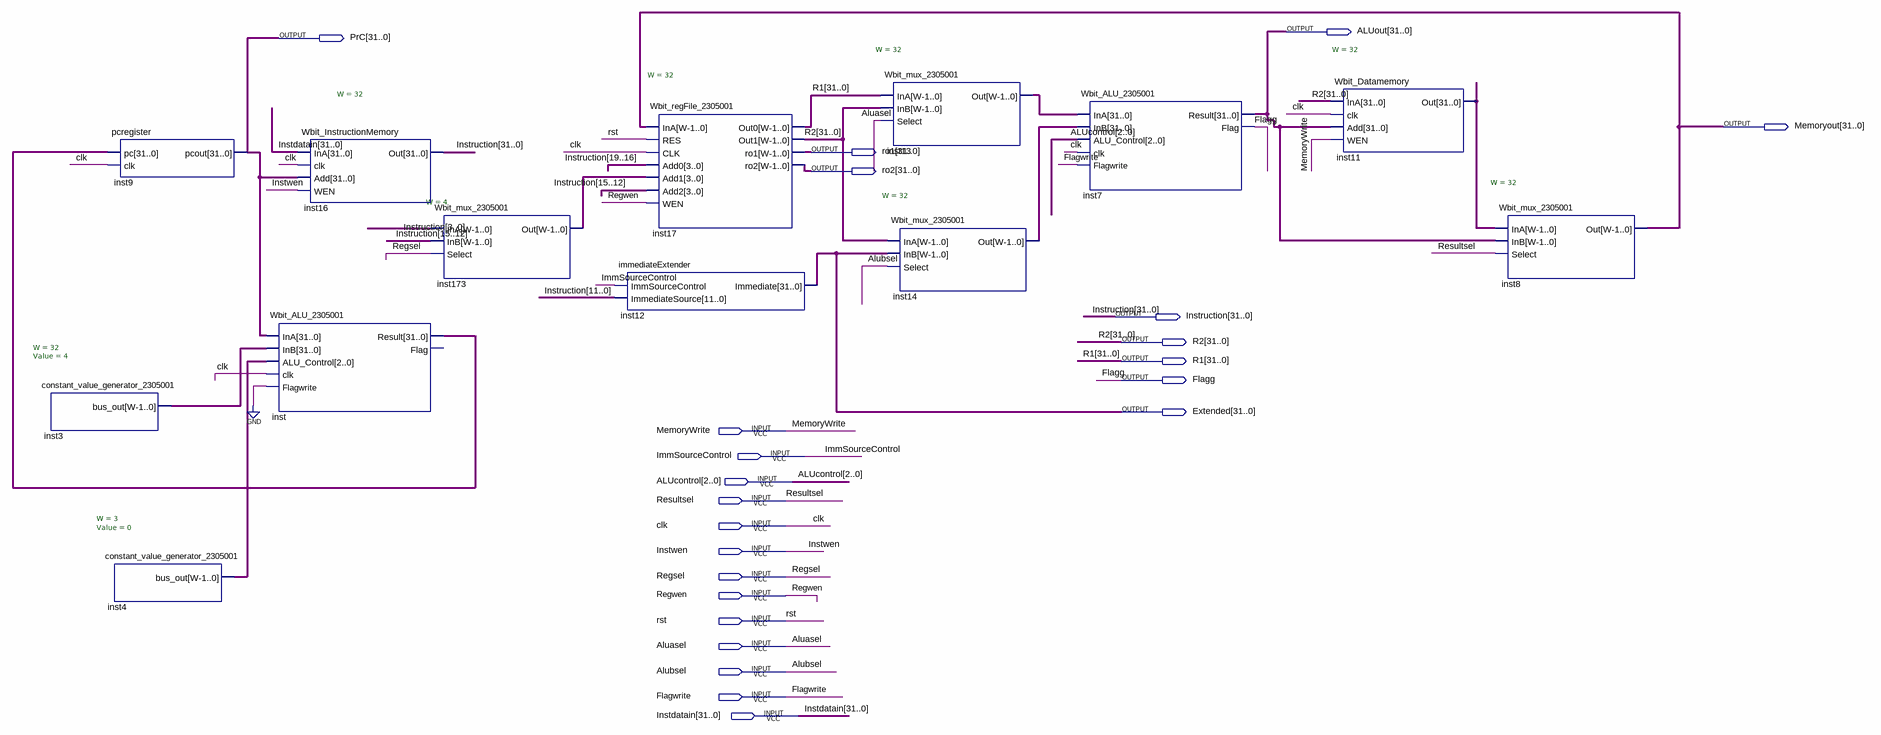
[diagram p0: schematic sheet]
// Quartus schematic Datapath.bdf as structural Verilog: 13 symbols, 23 pins
module Datapath (
  input  MemoryWrite,
  input  ImmSourceControl,
  input  [2:0] ALUcontrol,
  input  Resultsel,
  input  clk,
  input  Instwen,
  input  Regsel,
  input  Regwen,
  input  rst,
  input  Aluasel,
  input  Alubsel,
  input  Flagwrite,
  input  [31:0] Instdatain,
  output [31:0] ALUout,
  output [31:0] PrC,
  output [31:0] Memoryout,
  output [31:0] ro1,
  output [31:0] ro2,
  output [31:0] Instruction,
  output [31:0] R2,
  output [31:0] R1,
  output Flagg,
  output [31:0] Extended
);

  wire [2:0] inst4_bus_out;
  wire [3:0] inst173_out;
  wire [31:0] inst3_bus_out, inst11_out, inst13_out, inst14_out, inst_result;

  constant_value_generator_2305001 #(.W(32), .Value(4)) inst3 (.bus_out(inst3_bus_out));
  constant_value_generator_2305001 #(.W(3), .Value(0)) inst4 (.bus_out(inst4_bus_out));
  pcregister inst9 (.pc(inst_result), .clk(clk), .pcout(PrC));
  Wbit_InstructionMemory #(.W(32)) inst16 (.InA(Instdatain), .clk(clk), .Add(PrC), .WEN(Instwen), .Out(Instruction));
  Wbit_ALU_2305001 inst (
    .InA(PrC), .InB(inst3_bus_out), .ALU_Control(inst4_bus_out), .clk(clk), .Flagwrite(1'b0),
    .Result(inst_result));  // open: Flag
  Wbit_mux_2305001 #(.W(4)) inst173 (
    .InA(Instruction[3:0]), .InB(Instruction[15:12]), .Select(Regsel), .Out(inst173_out));
  Wbit_regFile_2305001 #(.W(32)) inst17 (
    .InA(Memoryout), .RES(rst), .CLK(clk), .Add0(Instruction[19:16]), .Add1(inst173_out),
    .Add2(Instruction[15:12]), .WEN(Regwen), .Out0(R1), .Out1(R2), .ro1(ro1), .ro2(ro2));
  immediateExtender inst12 (
    .ImmSourceControl(ImmSourceControl), .ImmediateSource(Instruction[11:0]), .Immediate(Extended));
  Wbit_mux_2305001 #(.W(32)) inst13 (.InA(R1), .InB(R2), .Select(Aluasel), .Out(inst13_out));
  Wbit_mux_2305001 #(.W(32)) inst14 (.InA(R2), .InB(Extended), .Select(Alubsel), .Out(inst14_out));
  Wbit_ALU_2305001 inst7 (
    .InA(inst13_out), .InB(inst14_out), .ALU_Control(ALUcontrol), .clk(clk), .Flagwrite(Flagwrite),
    .Result(ALUout), .Flag(Flagg));
  Wbit_Datamemory #(.W(32)) inst11 (.InA(R2), .clk(clk), .Add(ALUout), .WEN(MemoryWrite), .Out(inst11_out));
  Wbit_mux_2305001 #(.W(32)) inst8 (.InA(inst11_out), .InB(ALUout), .Select(Resultsel), .Out(Memoryout));
endmodule
